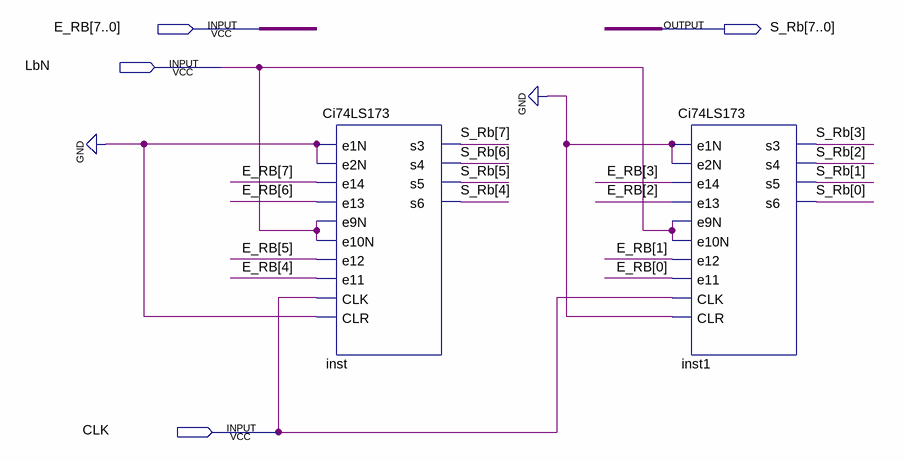
[diagram p0: schematic sheet]
// Quartus schematic Registrador_B.bdf as structural Verilog: 2 symbols, 4 pins
module Registrador_B (
  input  [7:0] E_RB,
  input  LbN,
  input  CLK,
  output [7:0] S_Rb
);

  Ci74LS173 inst (
    .e1N(1'b0), .e2N(1'b0), .e14(E_RB[7]), .e13(E_RB[6]), .e9N(LbN), .e10N(LbN), .e12(E_RB[5]),
    .e11(E_RB[4]), .CLK(CLK), .CLR(1'b0), .s3(S_Rb[7]), .s4(S_Rb[6]), .s5(S_Rb[5]), .s6(S_Rb[4]));
  Ci74LS173 inst1 (
    .e1N(1'b0), .e2N(1'b0), .e14(E_RB[3]), .e13(E_RB[2]), .e9N(LbN), .e10N(LbN), .e12(E_RB[1]),
    .e11(E_RB[0]), .CLK(CLK), .CLR(1'b0), .s3(S_Rb[3]), .s4(S_Rb[2]), .s5(S_Rb[1]), .s6(S_Rb[0]));
endmodule
